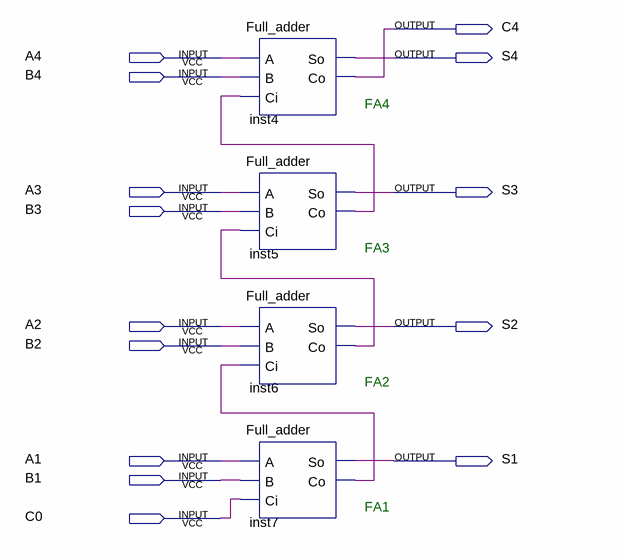
[diagram p0: schematic sheet]
// Quartus schematic 4bit_adder_G.bdf as structural Verilog: 4 symbols, 14 pins
module \4bit_adder_G  (
  input  A4,
  input  B4,
  input  A3,
  input  B3,
  input  A2,
  input  B2,
  input  A1,
  input  B1,
  input  C0,
  output C4,
  output S4,
  output S3,
  output S2,
  output S1
);

  wire inst5_co, inst6_co, inst7_co;

  Full_adder inst4 (.A(A4), .B(B4), .Ci(inst5_co), .So(S4), .Co(C4));
  Full_adder inst5 (.A(A3), .B(B3), .Ci(inst6_co), .So(S3), .Co(inst5_co));
  Full_adder inst6 (.A(A2), .B(B2), .Ci(inst7_co), .So(S2), .Co(inst6_co));
  Full_adder inst7 (.A(A1), .B(B1), .Ci(C0), .So(S1), .Co(inst7_co));

  // Notes on the sheet:
  //   FA4
  //   FA3
  //   FA2
  //   FA1
endmodule
